# EAGLE design Regolatori_LM317 (EAGLE 9.5.0)
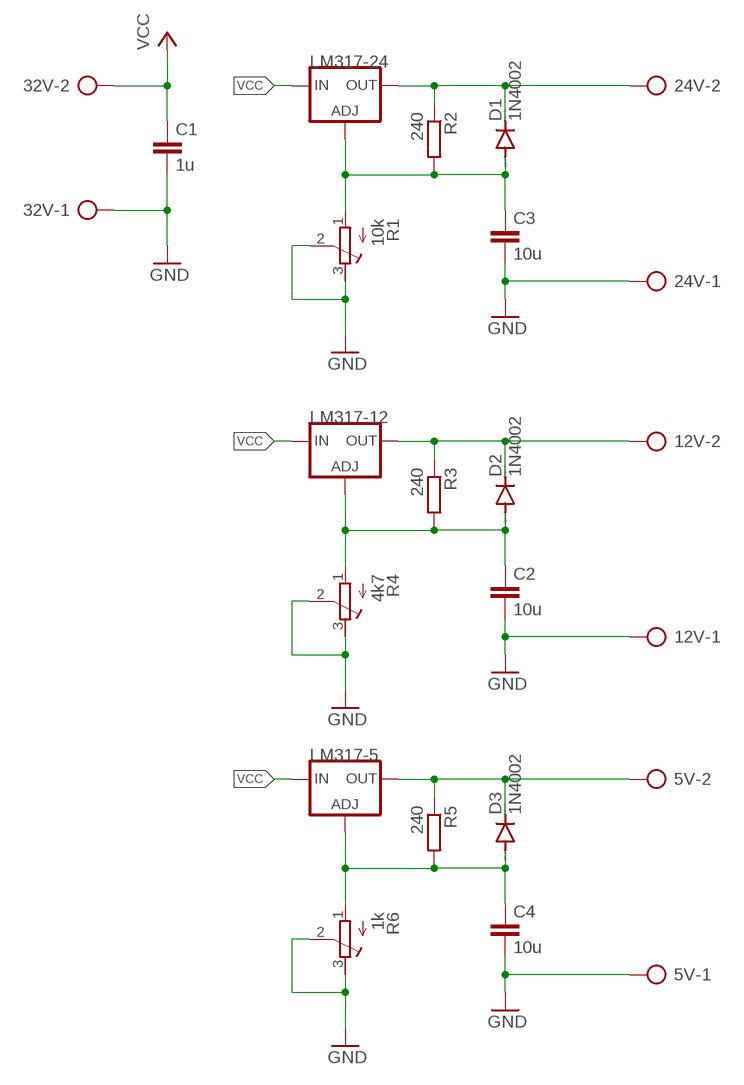
[diagram p0: schematic, sheet 1]

## Parts
5V  SMKDSP_1,5/2  [SMKDSP_1,5/2]
12V  SMKDSP_1,5/2  [SMKDSP_1,5/2]
24V  SMKDSP_1,5/2  [SMKDSP_1,5/2]
32V  SMKDSP_1,5/2  [SMKDSP_1,5/2]
C1  1u  C-EU025-025X050  [C025-025X050]
C2  10u  C-EU025-025X050  [C025-025X050]
C3  10u  C-EU025-025X050  [C025-025X050]
C4  10u  C-EU025-025X050  [C025-025X050]
D1  1N4002  1N4004DO-41  [DIOAD860W70L460D235B]
D2  1N4002  1N4004DO-41  [DIOAD860W70L460D235B]
D3  1N4002  1N4004DO-41  [DIOAD860W70L460D235B]
LM317-5  LM317TS317TS_TO220  [TO220V]
LM317-12  LM317TS317TS_TO220  [TO220V]
LM317-24  LM317TS317TS_TO220  [TO220V]
R1  10k  R-TRIMM64W  [RTRIM64W]
R2  240  R-EU_0204/7  [0204/7]
R3  240  R-EU_0204/7  [0204/7]
R4  4k7  R-TRIMM64W  [RTRIM64W]
R5  240  R-EU_0204/7  [0204/7]
R6  1k  R-TRIMM64W  [RTRIM64W]

## Nets
GND: 5V.1 12V.1 24V.1 32V.1 C1.2 C2.2 C3.2 C4.2 R1.2(S) R1.3(E) R4.2(S) R4.3(E) R6.2(S) R6.3(E)
N$1: 24V.2 D1.1(C) LM317-24.2(OUT) R2.1
N$4: C2.1 D2.2(A) LM317-12.1(ADJ) R3.2 R4.1(A)
N$5: 12V.2 D2.1(C) LM317-12.2(OUT) R3.1
N$6: C4.1 D3.2(A) LM317-5.1(ADJ) R5.2 R6.1(A)
N$7: 5V.2 D3.1(C) LM317-5.2(OUT) R5.1
N$9: C3.1 D1.2(A) LM317-24.1(ADJ) R1.1(A) R2.2
VCC: 32V.2 C1.1 LM317-5.3(IN) LM317-12.3(IN) LM317-24.3(IN)

## Library data of the parts
5V 12V 24V 32V = con-phoenix-smkdsp:SMKDSP_1,5/2: Printklemme, Nennstrom: 17,5 A, Bemessungsspannung: 250 V, Raster: 5,0 mm Source: http://eshop.phoenixcontact.de .. 1733415.pdf; MF: FARNELL; MPN: 1733570; OC_FARNELL: 3041244; OC_NEWARK: 69C8588
C1-C4 = rcl:C-EU: CAPACITOR, European symbol; SPICEPREFIX: C
D1-D3 = diode_MOD:1N4004: DIODE general purpose rectifier, 1 A
LM317-5 LM317-12 LM317-24 = v-reg:LM317TS: VOLTAGE REGULATOR
R1 R4 R6 = rcl:R-TRIMM: Trimm resistor; SPICEMODEL: X; SPICEPREFIXL: POT
R2 R3 R5 = rcl:R-EU_: RESISTOR, European symbol; SPICEPREFIX: R

## Board
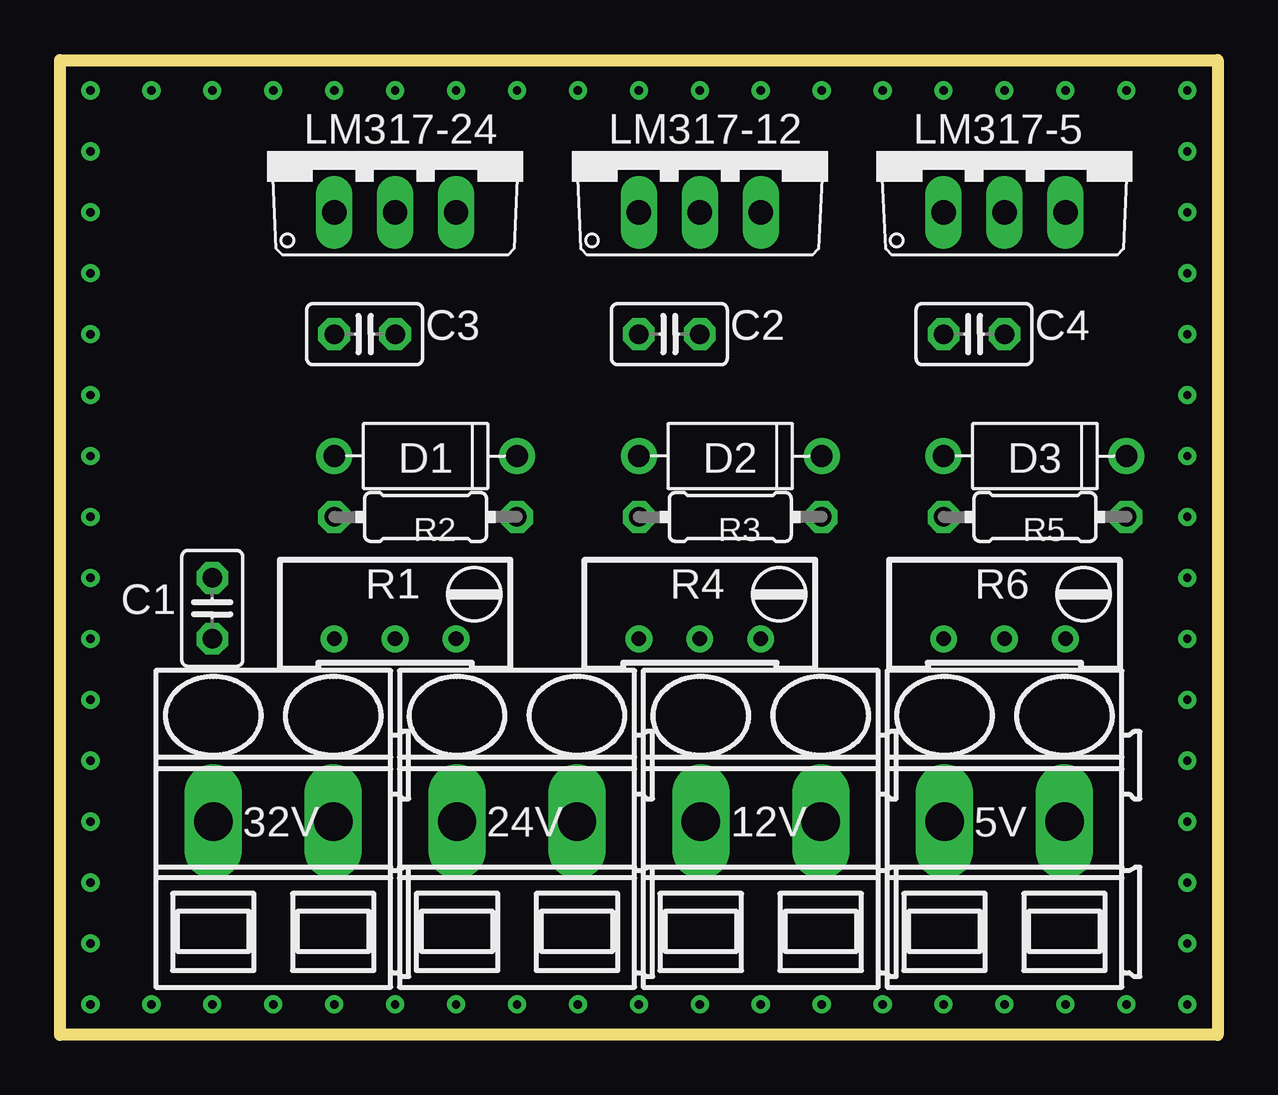
[diagram p1: board, top side]
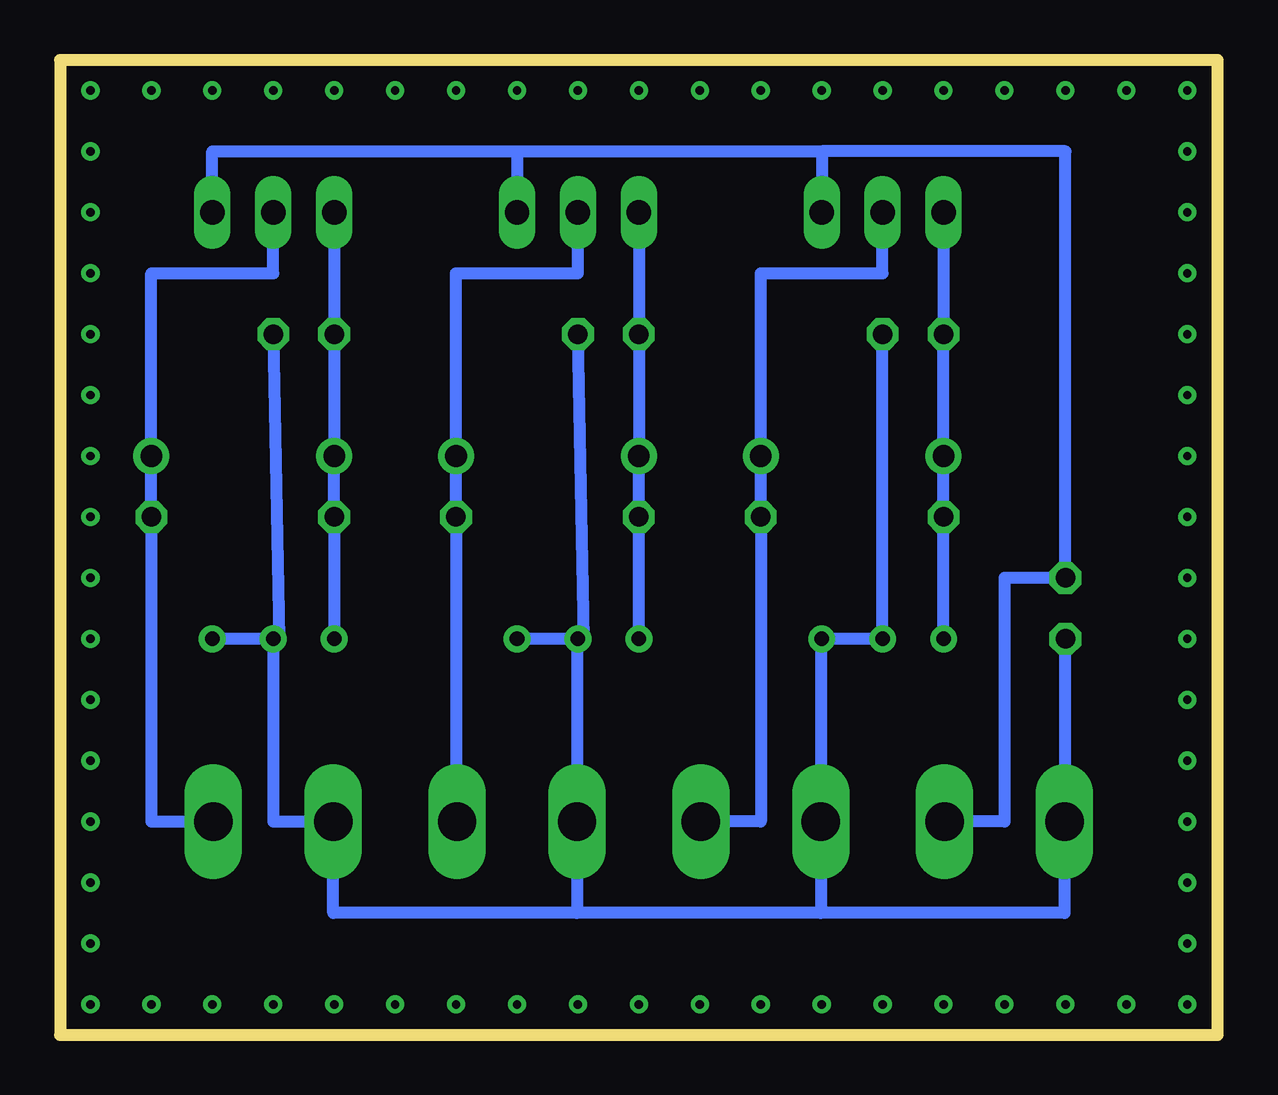
[diagram p2: board, bottom side, seen from below]

Size 48.26 x 40.64 mm. Coordinates in mm from the lower left corner, seen from the top.
Outline: 0,0 0,40.64 48.26,40.64 48.26,0 0,0
Copper layers (1*16): Top 0.035mm / dielectric 1.5mm / Bottom 0.035mm
Design rules "default": minimum track width 6mil, minimum drill 0.35mm, track to track 6mil, track to pad 6mil, pad to pad 6mil, via to via 6mil, smd to smd 6mil, copper to edge 40mil, drill to drill 6mil, minimum pad ring 10mil, minimum via ring 8mil, stop-mask expansion 4mil, vias tented up to drill 0mil, thermal gap 10mil

### Footprints (pad centres in the part's own frame; a part is rotated, then mirrored left to right if it is on the bottom)
SMKDSP_1,5/2 = drill 1.6 pad 1.8 long: 1 -2.5,0; 2 2.5,0
C025-025X050 = drill 0.813 octagon: 1 -1.27,0; 2 1.27,0
DIOAD860W70L460D235B = drill 0.9 pad 1.5: 1 -3.81,0; 2 3.81,0
TO220V = drill 1.016 long: 1 -2.54,-2.54; 2 0,-2.54; 3 2.54,-2.54
RTRIM64W = drill 0.61: 1 1.27,-2.54; 2 1.27,0; 3 1.27,2.54
0204/7 = drill 0.813 octagon: 1 -3.81,0; 2 3.81,0

### Placement (x,y rotation side)
5V  39.37,8.89 0 top
12V  29.21,8.89 0 top
24V  19.05,8.89 0 top
32V  8.89,8.89 0 top
C1  6.35,17.78 270 top
C2  25.4,29.21 0 top
C3  12.7,29.21 0 top
C4  38.1,29.21 0 top
D1  15.24,24.13 180 top
D2  27.94,24.13 180 top
D3  40.64,24.13 180 top
LM317-5  39.37,36.83 0 top
LM317-12  26.67,36.83 0 top
LM317-24  13.97,36.83 0 top
R1  13.97,17.78 270 top
R2  15.24,21.59 180 top
R3  27.94,21.59 180 top
R4  26.67,17.78 270 top
R5  40.64,21.59 180 top
R6  39.37,17.78 270 top

### Tracks (layer width: path | path; a pad name or v marks a point on that pad's centre or on a via)
GND
  Bottom 0.508: C3.2 R1.2 R1.3 16.55,16.51 24V.1 16.55,5.08 | R4.2 R4.3 | R6.2 R6.3 | C1.2 6.35,8.89 32V.1 6.39,5.08 16.55,5.08 | C4.2 39.12,16.51 R6.2 | R4.2 26.42,16.51 C2.2 | R4.2 26.71,16.51 12V.1 26.71,5.08 | R6.2 39.37,8.89 5V.1 36.87,5.08 26.71,5.08 | 16.55,5.08 26.71,5.08
N$1
  Bottom 0.508: LM317-24.2 13.97,31.75 19.05,31.75 D1.1 R2.1 19.05,8.89 24V.2
N$2  (via drill 0.35)
  other vias: 1.27,8.89
N$3  (via drill 0.35)
  other vias: 1.27,11.43
N$4
  Bottom 0.508: R4.1 R3.2 D2.2 C2.1 LM317-12.1
N$5
  Bottom 0.508: LM317-12.2 26.67,31.75 31.75,31.75 D2.1 R3.1 31.75,8.89 12V.2
N$6
  Bottom 0.508: R6.1 R5.2 D3.2 C4.1 LM317-5.1
N$7
  Bottom 0.508: LM317-5.2 39.37,31.75 44.45,31.75 D3.1 R5.1 44.45,8.89 5V.2
N$8  (via drill 0.35)
  other vias: 1.27,13.97
N$9
  Bottom 0.508: LM317-24.1 C3.1 D1.2 R2.2 R1.1
N$10  (via drill 0.35)
  other vias: 1.27,16.51
N$11  (via drill 0.35)
  other vias: 1.27,19.05
N$12  (via drill 0.35)
  other vias: 1.27,6.35
N$13  (via drill 0.35)
  other vias: 1.27,3.81
N$14  (via drill 0.35)
  other vias: 3.81,1.27
N$15  (via drill 0.35)
  other vias: 1.27,21.59
N$16  (via drill 0.35)
  other vias: 1.27,24.13
N$17  (via drill 0.35)
  other vias: 1.27,26.67
N$18  (via drill 0.35)
  other vias: 1.27,29.21
N$19  (via drill 0.35)
  other vias: 1.27,31.75
N$20  (via drill 0.35)
  other vias: 1.27,34.29
N$21  (via drill 0.35)
  other vias: 1.27,36.83
N$22  (via drill 0.35)
  other vias: 3.81,39.37
N$23  (via drill 0.35)
  other vias: 6.35,39.37
N$24  (via drill 0.35)
  other vias: 8.89,39.37
N$25  (via drill 0.35)
  other vias: 11.43,39.37
N$26  (via drill 0.35)
  other vias: 13.97,39.37
N$27  (via drill 0.35)
  other vias: 16.51,39.37
N$28  (via drill 0.35)
  other vias: 19.05,39.37
N$29  (via drill 0.35)
  other vias: 21.59,39.37
N$30  (via drill 0.35)
  other vias: 24.13,39.37
N$31  (via drill 0.35)
  other vias: 26.67,39.37
N$32  (via drill 0.35)
  other vias: 29.21,39.37
N$33  (via drill 0.35)
  other vias: 31.75,39.37
N$34  (via drill 0.35)
  other vias: 34.29,39.37
N$35  (via drill 0.35)
  other vias: 36.83,39.37
N$36  (via drill 0.35)
  other vias: 39.37,39.37
N$37  (via drill 0.35)
  other vias: 41.91,39.37
N$38  (via drill 0.35)
  other vias: 44.45,39.37
N$39  (via drill 0.35)
  other vias: 46.99,39.37
N$40  (via drill 0.35)
  other vias: 46.99,36.83
N$41  (via drill 0.35)
  other vias: 46.99,34.29
N$42  (via drill 0.35)
  other vias: 46.99,31.75
N$43  (via drill 0.35)
  other vias: 46.99,29.21
N$44  (via drill 0.35)
  other vias: 46.99,26.67
N$45  (via drill 0.35)
  other vias: 46.99,24.13
N$46  (via drill 0.35)
  other vias: 46.99,21.59
N$47  (via drill 0.35)
  other vias: 46.99,19.05
N$48  (via drill 0.35)
  other vias: 46.99,16.51
N$49  (via drill 0.35)
  other vias: 46.99,13.97
N$50  (via drill 0.35)
  other vias: 46.99,11.43
N$51  (via drill 0.35)
  other vias: 46.99,8.89
N$52  (via drill 0.35)
  other vias: 46.99,6.35
N$53  (via drill 0.35)
  other vias: 46.99,3.81
N$54  (via drill 0.35)
  other vias: 46.99,1.27
N$55  (via drill 0.35)
  other vias: 44.45,1.27
N$56  (via drill 0.35)
  other vias: 41.91,1.27
N$57  (via drill 0.35)
  other vias: 39.37,1.27
N$58  (via drill 0.35)
  other vias: 36.83,1.27
N$59  (via drill 0.35)
  other vias: 34.29,1.27
N$60  (via drill 0.35)
  other vias: 31.75,1.27
N$61  (via drill 0.35)
  other vias: 29.21,1.27
N$62  (via drill 0.35)
  other vias: 26.67,1.27
N$63  (via drill 0.35)
  other vias: 21.59,1.27
N$64  (via drill 0.35)
  other vias: 24.13,1.27
N$65  (via drill 0.35)
  other vias: 19.05,1.27
N$66  (via drill 0.35)
  other vias: 6.35,1.27
N$67  (via drill 0.35)
  other vias: 8.89,1.27
N$68  (via drill 0.35)
  other vias: 13.97,1.27
N$69  (via drill 0.35)
  other vias: 11.43,1.27
N$70  (via drill 0.35)
  other vias: 16.51,1.27
N$71  (via drill 0.35)
  other vias: 1.27,1.27
N$72  (via drill 0.35)
  other vias: 1.27,39.37
VCC
  Bottom 0.508: LM317-5.3 41.91,36.83 29.21,36.83 | 29.21,36.83 LM317-12.3 | 29.21,36.83 16.51,36.83 | 16.51,36.83 LM317-24.3 | 32V.2 8.89,8.89 8.89,19.05 C1.1 6.35,36.83 16.51,36.83